# Altium schematic sheet Chanel.SchDoc
size 420 x 297 mm; Address1: Address1; Address2: Address2; Address3: Address3; Address4: Address4
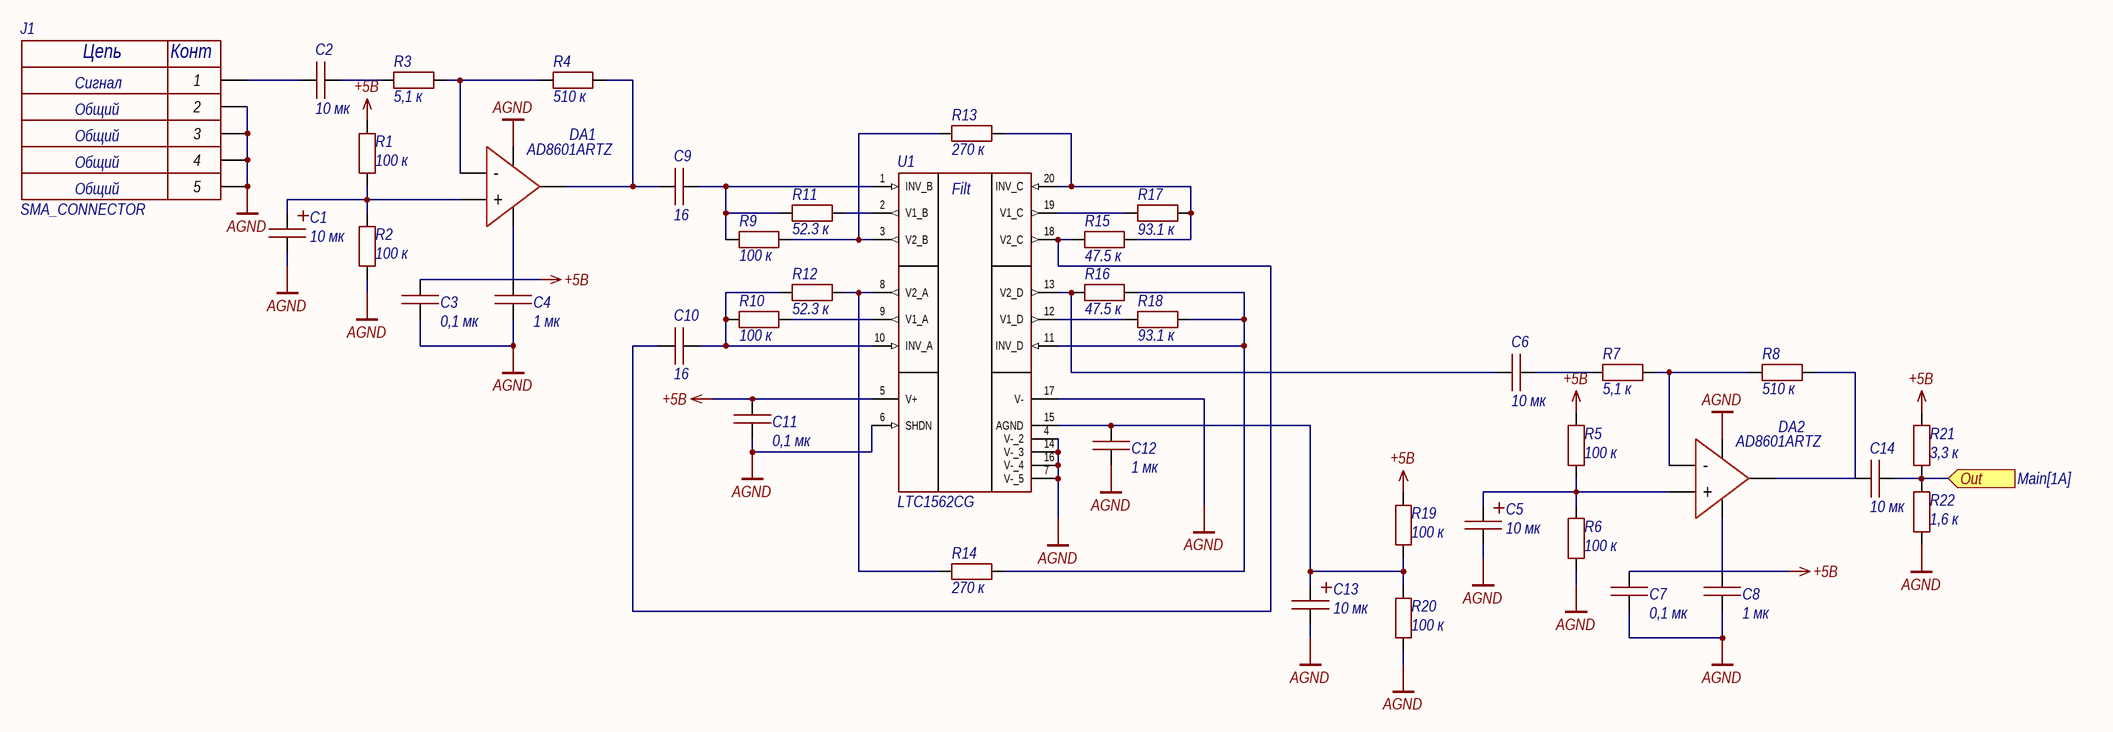
[diagram p0: Chanel.SchDoc]

## Parts
C1  value 10 мк  [TC_A]  (hidden comment: Capacitor)
C2  value 10 мк  [1210C]  (hidden comment: Capacitor)
C3  value 0,1 мк  [0603C]  (hidden comment: Capacitor)
C4  value 1 мк  [0603C]  (hidden comment: Capacitor)
C5  value 10 мк  [TC_A]  (hidden comment: Capacitor)
C6  value 10 мк  [1210C]  (hidden comment: Capacitor)
C7  value 0,1 мк  [0603C]  (hidden comment: Capacitor)
C8  value 1 мк  [0603C]  (hidden comment: Capacitor)
C9  value 16  [0603C]  (hidden comment: Capacitor)
C10  value 16  [0603C]  (hidden comment: Capacitor)
C11  value 0,1 мк  [0603C]  (hidden comment: Capacitor)
C12  value 1 мк  [0603C]  (hidden comment: Capacitor)
C13  value 10 мк  [TC_A]  (hidden comment: Capacitor)
C14  value 10 мк  [1210C]  (hidden comment: Capacitor)
DA1  AD8601ARTZ  [SOT23-5]
DA2  AD8601ARTZ  [SOT23-5]
J1  SMA_CONNECTOR  [SMA_CONNECTOR]
R1  value 100 к  [0603R]  (hidden comment: Resistor)
R2  value 100 к  [0603R]  (hidden comment: Resistor)
R3  value 5,1 к  [0603R]  (hidden comment: Resistor)
R4  value 510 к  [0603R]  (hidden comment: Resistor)
R5  value 100 к  [0603R]  (hidden comment: Resistor)
R6  value 100 к  [0603R]  (hidden comment: Resistor)
R7  value 5,1 к  [0603R]  (hidden comment: Resistor)
R8  value 510 к  [0603R]  (hidden comment: Resistor)
R9  value 100 к  [0603R]  (hidden comment: Resistor)
R10  value 100 к  [0603R]  (hidden comment: Resistor)
R11  value 52.3 к  [0603R]  (hidden comment: Resistor)
R12  value 52.3 к  [0603R]  (hidden comment: Resistor)
R13  value 270 к  [0603R]  (hidden comment: Resistor)
R14  value 270 к  [0603R]  (hidden comment: Resistor)
R15  value 47.5 к  [0603R]  (hidden comment: Resistor)
R16  value 47.5 к  [0603R]  (hidden comment: Resistor)
R17  value 93.1 к  [0603R]  (hidden comment: Resistor)
R18  value 93.1 к  [0603R]  (hidden comment: Resistor)
R19  value 100 к  [0603R]  (hidden comment: Resistor)
R20  value 100 к  [0603R]  (hidden comment: Resistor)
R21  value 3,3 к  [0603R]  (hidden comment: Resistor)
R22  value 1,6 к  [0603R]  (hidden comment: Resistor)
U1  LTC1562CG  [20-SSOP]

## Ports
Out (in, see Main[1A])

## Nets
+5В: C3.2 C4.2 C7.2 C8.2 C11.2 DA1.5(VCC) DA2.5(VCC) R1.2 R5.2 R19.2 R21.2 U1.5(V+)
AGND: C1.2 C3.1 C4.1 C5.2 C7.1 C8.1 C11.1 C12.1 C13.2 DA1.2(GND) DA2.2(GND) J1.G1(2) J1.G2(3) J1.G3(4) J1.G4(5) R2.1 R6.1 R20.1 R22.1 U1.4(V-_2) U1.6(SHDN) U1.7(V-_5) U1.14(V-_3) U1.16(V-_4) U1.17(V-)
Out: C14.2 R21.1 R22.2 ; port Out
NetC1_1: C1.1 DA1.3(+) R1.1 R2.2
NetC2_1: C2.1 J1.1
NetC2_2: C2.2 R3.2
NetC5_1: C5.1 DA2.3(+) R5.1 R6.2
NetC6_1: C6.1 R16.1 U1.13(V2_D)
NetC6_2: C6.2 R7.2
NetC9_1: C9.1 DA1.1 R4.2
NetC9_2: C9.2 R9.1 R11.1 U1.1(INV_B)
NetC10_1: C10.1 R15.1 U1.18(V2_C)
NetC10_2: C10.2 R10.1 R12.1 U1.10(INV_A)
NetC12_2: C12.2 C13.1 R19.1 R20.2 U1.15(AGND)
NetC14_1: C14.1 DA2.1 R8.2
NetDA1_4: DA1.4(-) R3.1 R4.1
NetDA2_4: DA2.4(-) R7.1 R8.1
NetR9_2: R9.2 R13.1 U1.3(V2_B)
NetR10_2: R10.2 U1.9(V1_A)
NetR11_2: R11.2 U1.2(V1_B)
NetR12_2: R12.2 R14.1 U1.8(V2_A)
NetR13_2: R13.2 R15.2 R17.2 U1.20(INV_C)
NetR14_2: R14.2 R16.2 R18.2 U1.11(INV_D)
NetR17_1: R17.1 U1.19(V1_C)
NetR18_1: R18.1 U1.12(V1_D)

## Notes on the sheet
- Перв. примен.
- Справ. №
- Подп. и дата
- Инв. № дубл.
- Взам. инв. №
- Инв. № подл.
- Изм.
- Лист
- № докум.
- Подп.
- Дата
- Копировал
- Формат А3
- (in symbol LTC1562CG) Filt
- (in symbol SMA_CONNECTOR) Цепь; Конт; Сигнал; Общий

## Library data of the parts
C1 C5 C13 = Capacitor_10u_10_50V_TC_A: Танталовый конденсатор; Tolerance: 0,1; Voltage (V): 50; Type: Tantalum; Capacity (uF): 10; Part Number: Capacitor_10u_10_50V_TC_A
C2 C6 C14 = Capacitor_10u_10_35V_X7R_1210C: Конденсатор 1210C ёмкостью 10 мк 10%, 35 В, X7R; Voltage (V): 35; Capacity (nF): 10000; Part Number: Capacitor_10u_10_35V_X7R_1210C; Tolerance: 10%; Dielectric: X7R
C3 C7 C11 = Capacitor_0,1u_10_50V_X7R_0603C: Конденсатор 0603C ёмкостью 0,1 мк 10%, 50 В, X7R; Voltage (V): 50; Capacity (nF): 100; Part Number: Capacitor_0,1u_10_50V_X7R_0603C; Tolerance: 10%; Dielectric: X7R
C4 C8 C12 = Capacitor_1u_10_50V_X7R_0603C: Конденсатор 0603C ёмкостью 1 мк 10%, 50 В, X7R; Voltage (V): 50; Capacity (nF): 1000; Part Number: Capacitor_1u_10_50V_X7R_0603C; Tolerance: 10%; Dielectric: X7R
C9 C10 = Capacitor_1n_10_50V_X7R_0603C: Конденсатор 0603C ёмкостью 1 н 10%, 50 В, X7R; Voltage (V): 50; Capacity (nF): 1; Part Number: Capacitor_1n_10_50V_X7R_0603C; Tolerance: 10%; Dielectric: X7R
DA1 DA2 = TS951ILT: Операционный усилитель Rail-to-Rail, 1-канальный; Автор: glebmih; Part Number: TS951ILT
J1 = SMA_CONNECTOR: Straight SMA Connector; MP: altium_native_batch; Value: *; Package: None; Availability: Unavailable; Price: None
R1-R3 R5-R7 R19 R20 = Resistor_100k_1_0603: Резистор номиналом 100 кОм 1%; Power: *; Part Number: Resistor_100k_1_0603; Tolerance: 1%
R4 R8 = Resistor_510k_1_0603: Резистор номиналом 510 кОм 1%; Power: *; Part Number: Resistor_510k_1_0603; Tolerance: 1%
R9-R14 = Resistor_51k_1_0603: Резистор номиналом 51 кОм 1%; Power: *; Part Number: Resistor_51k_1_0603; Tolerance: 1%
R15 R16 = Resistor_47k_1_0603: Резистор номиналом 47 кОм 1%; Power: *; Part Number: Resistor_47k_1_0603; Tolerance: 1%
R17 R18 = Resistor_91k_1_0603: Резистор номиналом 91 кОм 1%; Power: *; Part Number: Resistor_91k_1_0603; Tolerance: 1%
R21 = Resistor_3.3k_1_0603: Резистор номиналом 3,3 кОм 1%; Power: *; Part Number: Resistor_3.3k_1_0603; Tolerance: 1%
R22 = Resistor_1.6k_1_0603: Резистор номиналом 1,6 кОм 1%; Power: *; Part Number: Resistor_1.6k_1_0603; Tolerance: 1%
U1 = LTC1562CG: Микросхема счетверённый активный полосовый фильтр; MF: Analog Devices; MP: LTC1562CG#TR; SnapEDA_Link: https://www.snapeda.com/parts/LTC1562CG%23TR/Analog+Devices/view-part/?ref=snap; Package: SSOP-20 Linear Technology; Value: *; Check_prices: https://www.snapeda.com/parts/LTC1562CG%23TR/Analog+Devices/view-part/?ref=eda; Part Number: LTC1562CG